# EasyEDA Pro project STM32 Minimum System.eprj

# Schematic Schematic1
Create Date: 2023-11-04; Page Name: P1; Project Name: STM32 Minimum System; Schematic Name: Schematic1; Update Date: 2023-12-27; Company: EasyEDA.com; Drawed: EasyEDA Pro; Page Size: A3; Part Number: JLCPCB-001; Reviewed: EasyEDA Pro; Version: V0.1
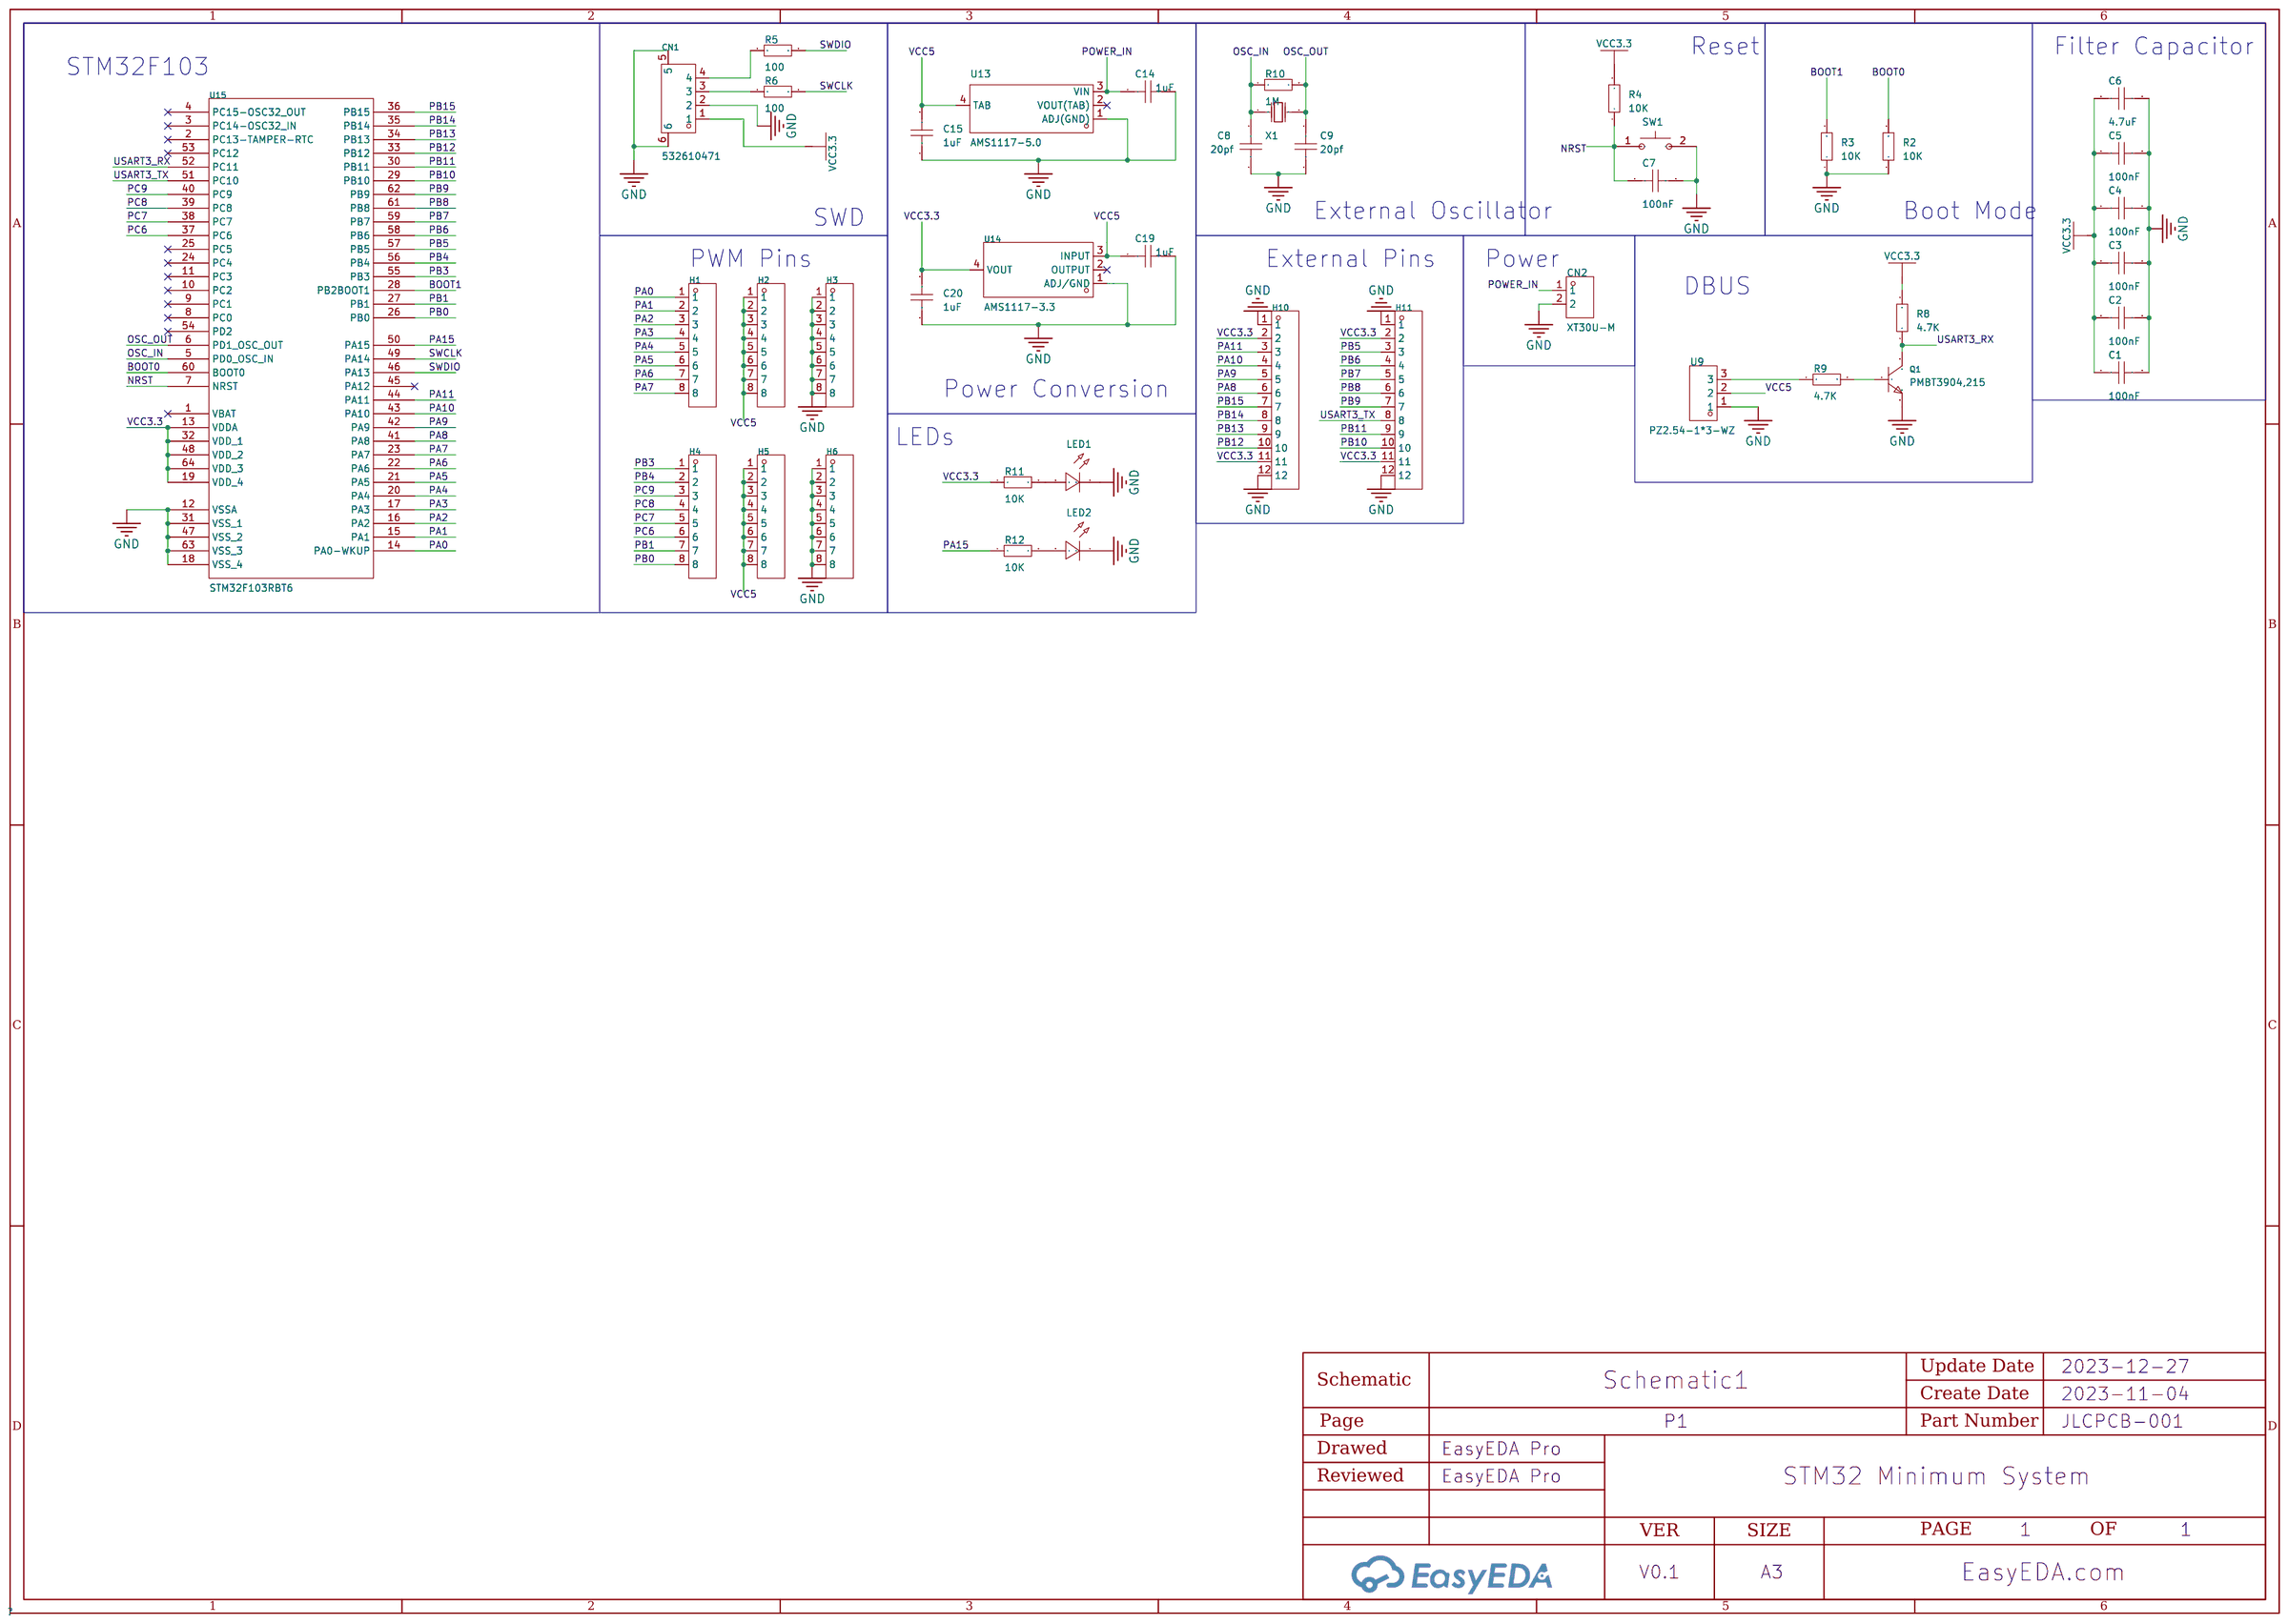
[diagram p0: schematic sheet]

## Parts
C1  100nF  [C0603]
C2  100nF  [C0603]
C3  100nF  [C0603]
C4  100nF  [C0603]
C5  100nF  [C0603]
C6  4.7uF  [C0603]
C7  100nF  [C0603]
C8  20pf  [C0603]
C9  20pf  [C0603]
C14  1uF  [C0603]
C15  1uF  [C0603]
C19  1uF  [C0603]
C20  1uF  [C0603]
CN1  532610471  [CONN-SMD_4P-P1.25_53261-0471]
CN2  XT30U-M  [CONN-TH_XT30U-M]
H1  KH-2.54PH180-1X8P-L11.5  [HDR-TH_8P-P2.54-V-M]
H2  KH-2.54PH180-1X8P-L11.5  [HDR-TH_8P-P2.54-V-M]
H3  KH-2.54PH180-1X8P-L11.5  [HDR-TH_8P-P2.54-V-M]
H4  KH-2.54PH180-1X8P-L11.5  [HDR-TH_8P-P2.54-V-M]
H5  KH-2.54PH180-1X8P-L11.5  [HDR-TH_8P-P2.54-V-M]
H6  KH-2.54PH180-1X8P-L11.5  [HDR-TH_8P-P2.54-V-M]
H10  KH-2.54PH180-1X12P-L11.5  [HDR-TH_12P-P2.54-V-M]
H11  KH-2.54PH180-1X12P-L11.5  [HDR-TH_12P-P2.54-V-M]
LED1  -  [LED0603-RD_GREEN]
LED2  -  [LED0603-BI_RG]
Q1  PMBT3904,215  [SOT-23_L2.9-W1.3-P1.90-LS2.4-BR]
R2  10K  [R0603]
R3  10K  [R0603]
R4  10K  [R0603]
R5  100  [R0603]
R6  100  [R0603]
R8  4.7K  [R0603]
R9  4.7K  [R0603]
R10  1M  [R0603]
R11  10K  [R0603]
R12  10K  [R0603]
SW1  1TS002C-2300-4300-CT  [SW-SMD_L6.0-W3.5-LS8.0-EH]
U9  PZ2.54-1*3-WZ  [HDR-TH_3P-P2.54-H-M-W7.7-P]
U13  AMS1117-5.0  [SOT-223_L6.7-W3.5-P2.30-BR]
U14  AMS1117-3.3  [SOT-223-3_L6.5-W3.4-P2.30-LS7.0-BR]
U15  STM32F103RBT6  [LQFP-64_L10.0-W10.0-P0.50-LS12.0-BL]
X1  8MHz  [CRYSTAL-SMD_L11.5-W4.8-LS12.7]

## Library data of the parts
C1-C9 C14 C15 C19 C20 = CAP_0603: Supplier Footprint: 0603
CN1 = 532610471: Reference Series:- Pitch:1.25mm Pins Structure:1x4P Number of Rows:1 Number of PINs Per Row:4 Row Spacing:- Mounting Style:- Contact Material:bronze; LCSC Part Name: 间距:1.25mm 1x4P; Supplier Part: C240847; Manufacturer: MOLEX; Supplier Footprint: SMD,P=1.25mm; JLCPCB Part Class: Extended Part; Datasheet: https://atta.szlcsc.com/upload/public/pdf/source/20180801/C240848_05185111BCEC053393D7785380F62CFD.pdf; Supplier: LCSC; Pitch: 1.25mm; Pins Structure: 1x4P; Number of Rows: 1; Number of PINs Per Row: 4; Contact Material: bronze
CN2 = XT30U-M: LCSC Part Name: AMASS(艾迈斯)轻量版锂电池插头公头 XT30U-M; Supplier Part: C99101; Manufacturer: AMASS(艾迈斯); JLCPCB Part Class: Extended Part; Datasheet: https://atta.szlcsc.com/upload/public/pdf/source/20170606/1496716542582.pdf; Supplier: LCSC
H1-H6 = KH-2.54PH180-1X8P-L11.5: Pin Structure:1x8P Pitch:2.54mm Number of Pins:8P Mounting Type:Straight Number of Rows:Plugin Row Spacing:- Circluar Pins/Square Pins:Square Pins Current Rating (Max):3A Voltage Rating (Max):- Length of Mating Pin:6mm Insulation Height:2.5mm Length of En; LCSC Part Name: 间距:2.54mm 1x8P 直插 方针; Supplier Part: C2905487; Manufacturer: kinghelm(金航标); Supplier Footprint: 插件,P=2.54mm; JLCPCB Part Class: Extended Part; Datasheet: https://atta.szlcsc.com/upload/public/pdf/source/20211019/E207DA256892DEA6FC546F48FC628120.pdf; Supplier: LCSC; Pin Structure: 1x8P; Pitch: 2.54mm; Number of Pins: 8P; Mounting Type: Straight; Number of Rows: Plugin; Circluar Pins/Square Pins: Square Pins; Current Rating (Max): 3A; Length of Mating Pin: 6mm; Insulation Height: 2.5mm; Length of End Connection Pin: 3mm; Operating Temperature Range: -40℃~+105℃; Color: Black
H10 H11 = KH-2.54PH180-1X12P-L11.5: Pin Structure:1x12P Pitch:2.54mm Number of Pins:12P Mounting Type:Straight Number of Rows:Plugin Row Spacing:- Circluar Pins/Square Pins:Square Pins Current Rating (Max):3A Voltage Rating (Max):- Length of Mating Pin:6mm Insulation Height:2.5mm Length of; LCSC Part Name: 间距:2.54mm 1x12P 直插 方针; Supplier Part: C2905489; Manufacturer: kinghelm(金航标); Supplier Footprint: 插件,P=2.54mm; JLCPCB Part Class: Extended Part; Datasheet: https://atta.szlcsc.com/upload/public/pdf/source/20211019/907BE828B313BB62427C82BE2EF837CA.pdf; Supplier: LCSC; Pin Structure: 1x12P; Pitch: 2.54mm; Number of Pins: 12P; Mounting Type: Straight; Number of Rows: Plugin; Circluar Pins/Square Pins: Square Pins; Current Rating (Max): 3A; Length of Mating Pin: 6mm; Insulation Height: 2.5mm; Length of End Connection Pin: 3mm; Operating Temperature Range: -40℃~+105℃; Color: Black
LED1 = LED_0603-G
LED2 = LED_0603-B: Supplier Footprint: 0603
Q1 = PMBT3904,215: Transistor Type: Collector Current (Ic): Collector-Emitter Breakdown Voltage (Vceo): Power Dissipation (Pd): DC Current Gain (hFE@Ic,Vce):100@10mA,1V DC Current Gain (hFE@Ic,Vce):100@10mA,1V Transition Frequency (fT):300MHz Collector Cut-Off Current (Icbo; LCSC Part Name: NPN 电流:200mA 耐压:40V; Supplier Part: C8667; Manufacturer: Nexperia(安世); Supplier Footprint: SOT-23; JLCPCB Part Class: Extended Part; Datasheet: https://atta.szlcsc.com/upload/public/pdf/source/20210520/C8667_82CC4B18F957EC74ED6E8B4E120941E6.pdf; Supplier: LCSC; DC Current Gain (hFE@Ic,Vce): 100@10mA,1V; Transition Frequency (fT): 300MHz; Collector Cut-Off Current (Icbo): 50nA; Collector-Emitter Saturation Voltage (VCE(sat)@Ic,Ib): 300mV@50mA,5mA
R2-R6 R8-R12 = Res_0603: Supplier Footprint: 0603
SW1 = 1TS002C-2300-4300-CT: Contact Current:50mA Voltage Rating (DC):12V Power Rating:0.6W Insulation Resistance:100MΩ Circuit:SPST Mounting Style:Brick nogging Actuator Style:Rectangle button Actuator/Cap Color:White With Lamp:No Operating Force:230gf@±50gf Mechanical Life:30000次 O; LCSC Part Name: 6*3.5*4.3mm 立贴 轻触开关; Supplier Part: C319340; Manufacturer: HYP(鸿源精密); Supplier Footprint: SMD,3.5x6mm; JLCPCB Part Class: Extended Part; Datasheet: https://atta.szlcsc.com/upload/public/pdf/source/20181106/C319340_6D4557880F4EAE8D4DD4D90C9114405F.pdf; Supplier: LCSC; Contact Current: 50mA; Voltage Rating (DC): 12V; Power Rating: 0.6W; Insulation Resistance: 100MΩ; Circuit: SPST; Mounting Style: Brick nogging; Actuator Style: Rectangle button; Actuator/Cap Color: White; With Lamp: No; Operating Force: 230gf@±50gf; Mechanical Life: 30000次; Operating Temperature: -40℃~+90℃; Pin Style: Gull Wing; Switch Length: 6mm; Switch Width: 3.5mm; Switch Height: 4.3mm; Strike Gundam: NO
U9 = PZ2.54-1*3-WZ: LCSC Part Name: 单排弯针 1*3 2.54 镀金环保UL认证; Supplier Part: C5360904; Manufacturer: ZHOURI(洲日); Supplier Footprint: 弯插,P=2.54mm; JLCPCB Part Class: Extended Part; Supplier: LCSC
U13 = AMS1117-5.0_C347223: Output Type: Output Polarity:Positive Number of Outputs:1 Maximum Input Voltage:18V Output Voltage:5V~5V Output Voltage:5V~5V Dropout Voltage:1.3V@(1A) Output Current:1A Power Supply Rejection Ratio (PSRR):60dB@(120Hz); LCSC Part Name: 输入18V 输出5V 1A; Supplier Part: C347223; Manufacturer: UMW(广东友台半导体); Supplier Footprint: SOT-223; JLCPCB Part Class: Extended Part; Datasheet: https://atta.szlcsc.com/upload/public/pdf/source/20211011/50CC665C22E3A66C08379A4A74BDA25C.pdf; Supplier: LCSC; Output Polarity: Positive; Number of Outputs: 1; Maximum Input Voltage: 18V; Output Voltage: 5V~5V; Dropout Voltage: 1.3V@(1A); Output Current: 1A; Power Supply Rejection Ratio (PSRR): 60dB@(120Hz)
U14 = AMS1117-3.3_C18212698: Supplier Part: C18212698; Manufacturer: TECH PUBLIC(台舟); Supplier Footprint: SOT-223; Datasheet: https://atta.szlcsc.com/upload/public/pdf/source/20231024/2F46361C191D0B74404CBB3E85314756.pdf; Supplier: LCSC
U15 = STM32F103RBT6: CPU Core:ARM Cortex-M3 CPU Maximum Speed:72MHz Operating Voltage Range:2V~3.6V Operating Voltage Range:2V~3.6V Program Storage Size:128KB Program Memory Type:FLASH RAM Size:20KB EEPROM:- GPIO Ports Number:51 ADC (Bit):12bit DAC (Bit):- PWM (Bit):- Univers; Supplier Part: C8735; Manufacturer: ST(意法半导体); Supplier Footprint: LQFP-64(10x10); JLCPCB Part Class: Extended Part; Datasheet: https://atta.szlcsc.com/upload/public/pdf/source/20150811/1457707344439.pdf; Supplier: LCSC; CPU Core: ARM Cortex-M3; CPU Maximum Speed: 72MHz; Operating Voltage Range: 2V~3.6V; Program Storage Size: 128KB; Program Memory Type: FLASH; RAM Size: 20KB; GPIO Ports Number: 51; ADC (Bit): 12bit; Universal Serial Bus: 有; Peripheral/Function: WDT；DMA；WDT；On-chip temperature sensor; Watchdog: 有; Infrared Data Association: 有; Low-Voltage Detect: 有; Direct Memory Access: 有; Internal Oscillator: 有; Operating Temperature Range: -40℃~+85℃
X1 = X49SM8MSD2SC: Crystal Type:49SMDCrystals Frequency: Frequency Tolerance:±20ppm Frequency Tolerance:±20ppm Load Capacitance: Frequency Stability:±30ppm Frequency Stability:±30ppm Operating Temperature: Operating Temperature:; LCSC Part Name: 8MHz ±20ppm 20pF; Supplier Part: C12674; Manufacturer: YXC(扬兴晶振); Supplier Footprint: HC-49S-SMD; JLCPCB Part Class: Basic Part; Datasheet: https://atta.szlcsc.com/upload/public/pdf/source/20210329/C106809_0E91E60850A780B284B63D653DC40EA4.pdf; Supplier: LCSC; Crystal Type: 49SMDCrystals; Frequency Tolerance: ±20ppm; Frequency Stability: ±30ppm

## Nets
GND: C1.2 C2.2 C3.2 C4.2 C5.2 C6.2 C7.1 C8.2 C9.2 C14.2 C15.1 C19.2 C20.1 CN1.2 CN1.5 CN1.6 CN2.2 H3.1 H3.2 H3.3 H3.4 H3.5 H3.6 H3.7 H3.8 H6.1 H6.2 H6.3 H6.4 H6.5 H6.6 H6.7 H6.8 H10.1 H10.12 H11.1 H11.12 LED1.1(C) LED2.1(C) Q1.2 R2.1 R3.1 SW1.2(B) U9.1 U13.1(ADJ(GND)) U14.1(ADJ/GND) U15.12(VSSA) U15.18(VSS_4) U15.31(VSS_1) U15.47(VSS_2) U15.63(VSS_3)
VCC3.3: C1.1 C2.1 C3.1 C4.1 C5.1 C6.1 C20.2 CN1.1 H10.2 H10.11 H11.2 H11.11 R4.2 R8.2 R11.1 U14.4(VOUT) U15.13(VDDA) U15.19(VDD_4) U15.32(VDD_1) U15.48(VDD_2) U15.64(VDD_3)
VCC5: C15.2 C19.1 H2.1 H2.2 H2.3 H2.4 H2.5 H2.6 H2.7 H2.8 H5.1 H5.2 H5.3 H5.4 H5.5 H5.6 H5.7 H5.8 U9.2 U13.4(TAB) U14.3(INPUT)
BOOT0: R2.2 U15.60(BOOT0)
BOOT1: R3.2 U15.28(PB2BOOT1)
NRST: C7.2 R4.1 SW1.1(A) U15.7(NRST)
OSC_IN: C8.1 R10.1 U15.5(PD0 OSC_IN) X1.1(OSC1)
OSC_OUT: C9.1 R10.2 U15.6(PD1 OSC_OUT) X1.2(OSC2)
PA0: H1.1 U15.14(PA0-WKUP)
PA1: H1.2 U15.15(PA1)
PA2: H1.3 U15.16(PA2)
PA3: H1.4 U15.17(PA3)
PA4: H1.5 U15.20(PA4)
PA5: H1.6 U15.21(PA5)
PA6: H1.7 U15.22(PA6)
PA7: H1.8 U15.23(PA7)
PA8: H10.6 U15.41(PA8)
PA9: H10.5 U15.42(PA9)
PA10: H10.4 U15.43(PA10)
PA11: H10.3 U15.44(PA11)
PA15: R12.1 U15.50(PA15)
PB0: H4.8 U15.26(PB0)
PB1: H4.7 U15.27(PB1)
PB3: H4.1 U15.55(PB3)
PB4: H4.2 U15.56(PB4)
PB5: H11.3 U15.57(PB5)
PB6: H11.4 U15.58(PB6)
PB7: H11.5 U15.59(PB7)
PB8: H11.6 U15.61(PB8)
PB9: H11.7 U15.62(PB9)
PB10: H11.10 U15.29(PB10)
PB11: H11.9 U15.30(PB11)
PB12: H10.10 U15.33(PB12)
PB13: H10.9 U15.34(PB13)
PB14: H10.8 U15.35(PB14)
PB15: H10.7 U15.36(PB15)
PC6: H4.6 U15.37(PC6)
PC7: H4.5 U15.38(PC7)
PC8: H4.4 U15.39(PC8)
PC9: H4.3 U15.40(PC9)
POWER_IN: C14.1 CN2.1 U13.3(VIN)
SWCLK: R6.2 U15.49(PA14)
SWDIO: R5.2 U15.46(PA13)
USART3_RX: Q1.3 R8.1 U15.52(PC11)
USART3_TX: H11.8 U15.51(PC10)
$1N3454: CN1.4 R5.1
$1N3498: CN1.3 R6.1
$1N7012: R9.1 U9.3
$1N7013: Q1.1 R9.2
$1N12545: LED1.2(A) R11.2
$1N12687: LED2.2(A) R12.2

Not connected (* = marked no-connect by the designer): U13 2(VOUT(TAB))*; U14 2(OUTPUT)*; U15 1(VBAT)* 2(PC13-TAMPER-RTC)* 3(PC14-OSC32_IN)* 4(PC15-OSC32_OUT)* 8(PC0)* 9(PC1)* 10(PC2)* 11(PC3)* 24(PC4)* 25(PC5)* 45(PA12)* 53(PC12)* 54(PD2)*

## Notes on the sheet
- Reset
- Filter Capacitor
- STM32F103
- External Oscillator
- Boot Mode
- SWD
- PWM Pins
- External Pins
- Power
- DBUS
- Power Conversion
- LEDs

# Board PCB1
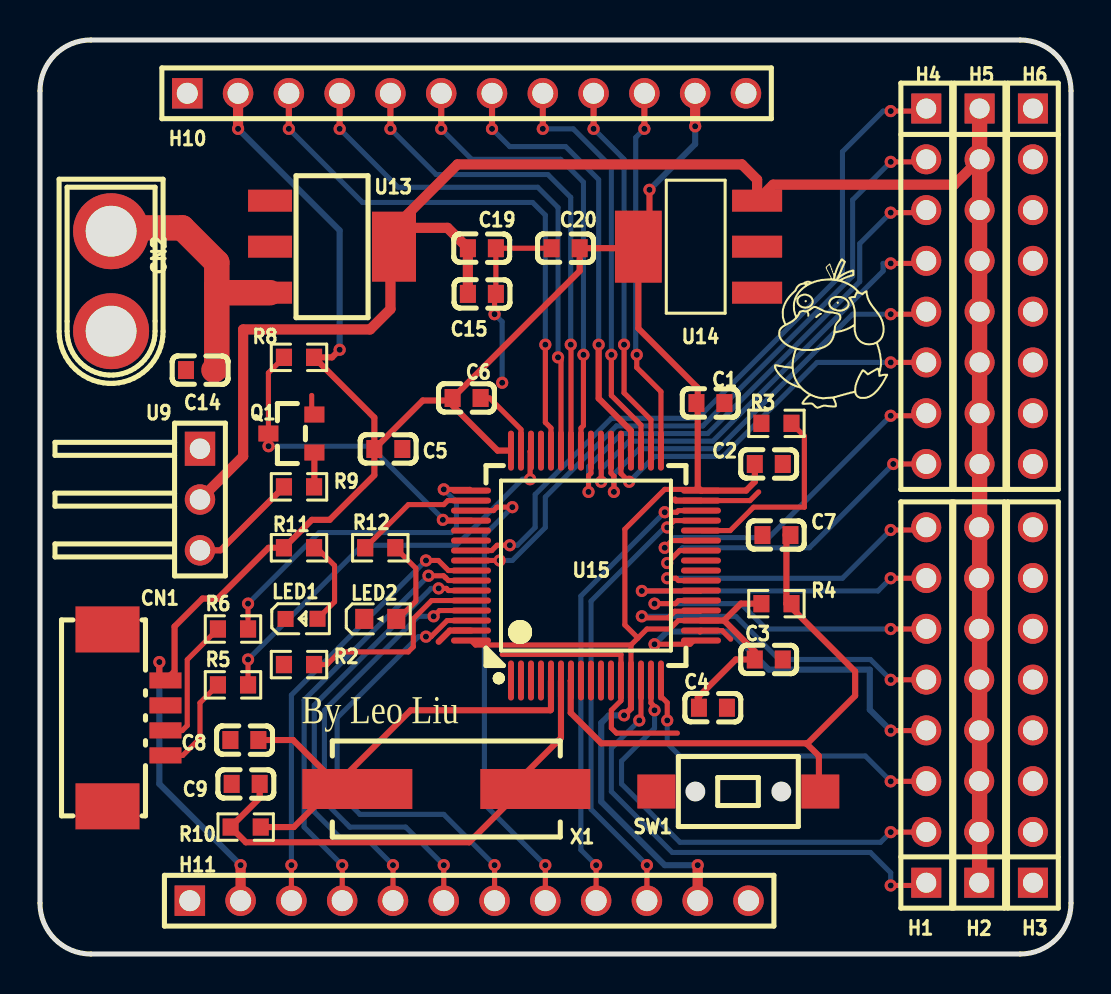
[diagram p1: board, top side]
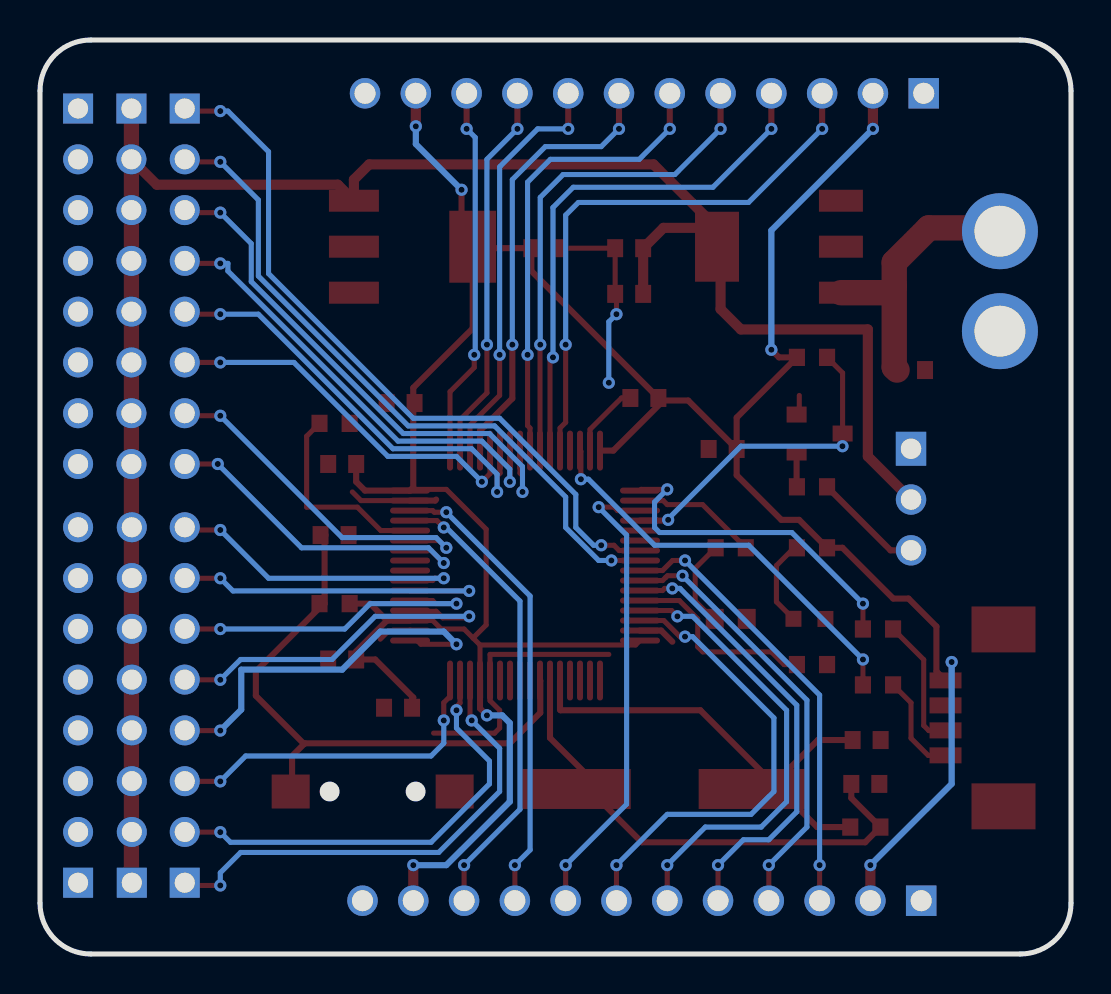
[diagram p2: board, bottom side, seen from below]

Outline 51.56 x 45.72 mm; copper layers: Top Layer, Bottom Layer. Coordinates in mm from the lower left corner of the outline.
Outline path: 0,43.18 0,2.54 arc(0.74,0.74) 2.54,0 49.02,0 arc(50.82,0.74) 51.56,2.54 51.56,43.18 arc(50.82,44.98) 49.02,45.72 2.54,45.72 arc(0.74,44.98) 0,43.18
Stack: Top Layer 0.035mm / Dielectric1 1.51mm FR4 er 4.5 / Bottom Layer 0.035mm

## Design rules (mm)
template: Custom Config
spacing copperThickness1oz (default): track to track 0.102, other pairs 0.152 to 0.3
spacing copperThickness2oz: track to track 0.203, other pairs 0.152 to 0.3
track width copperThickness1oz (default): min 0.127, default 0.254, max 2.54
track width copperThickness2oz: min 0.203, default 0.254, max 2.54
differential pair differentialPair (default): width min 0.127, default 0.254, max 2.54; gap min 0.152, default 0.152
via viaSize (default): diameter min 0.5, default 0.61, max 10; hole min 0.3, default 0.305, max 6.3

## Placement (name value [footprint] x y rotation side)
C1  100nF  [C0603]  33.53 27.56 0 top
C2  100nF  [C0603]  36.45 24.51 0 top
C3  100nF  [C0603]  36.45 14.73 0 top
C4  100nF  [C0603]  33.65 12.32 0 top
C5  100nF  [C0603]  17.42 25.26 0 top
C6  4.7uF  [C0603]  21.34 27.81 0 top
C7  100nF  [C0603]  36.83 20.95 0 top
C8  20pf  [C0603]  10.22 10.7 180 top
C9  20pf  [C0603]  10.29 8.51 180 top
C14  1uF  [C0603]  8 29.21 180 top
C15  1uF  [C0603]  22.1 33.02 180 top
C19  1uF  [C0603]  22.1 35.31 0 top
C20  1uF  [C0603]  26.29 35.31 0 top
CN1  532610471  [CONN-SMD_4P-P1.25_53261-0471]  4.83 11.81 270 top
CN2  XT30U-M  [CONN-TH_XT30U-M]  3.56 33.66 270 top
H1  KH-2.54PH180-1X8P-L11.5  [HDR-TH_8P-P2.54-V-M]  44.32 12.46 90 top
H2  KH-2.54PH180-1X8P-L11.5  [HDR-TH_8P-P2.54-V-M]  46.97 12.46 90 top
H3  KH-2.54PH180-1X8P-L11.5  [HDR-TH_8P-P2.54-V-M]  49.66 12.46 90 top
H4  KH-2.54PH180-1X8P-L11.5  [HDR-TH_8P-P2.54-V-M]  44.32 33.4 270 top
H5  KH-2.54PH180-1X8P-L11.5  [HDR-TH_8P-P2.54-V-M]  46.99 33.4 270 top
H6  KH-2.54PH180-1X8P-L11.5  [HDR-TH_8P-P2.54-V-M]  49.66 33.4 270 top
H10  KH-2.54PH180-1X12P-L11.5  [HDR-TH_12P-P2.54-V-M]  21.34 43.05 0 top
H11  KH-2.54PH180-1X12P-L11.5  [HDR-TH_12P-P2.54-V-M]  21.46 2.67 0 top
LED1  -  [LED0603-RD_GREEN]  13.08 16.76 0 top
LED2  -  [LED0603-BI_RG]  17.02 16.76 0 top
Q1  PMBT3904,215  [SOT-23_L2.9-W1.3-P1.90-LS2.4-BR]  12.57 26.03 0 top
R2  10K  [R0603]  12.95 14.48 0 top
R3  10K  [R0603]  36.83 26.54 0 top
R4  10K  [R0603]  36.83 17.53 180 top
R5  100  [R0603]  9.65 13.46 0 top
R6  100  [R0603]  9.65 16.26 0 top
R8  4.7K  [R0603]  12.95 29.84 0 top
R9  4.7K  [R0603]  12.95 23.37 0 top
R10  1M  [R0603]  10.29 6.35 180 top
R11  10K  [R0603]  12.95 20.32 0 top
R12  10K  [R0603]  17.02 20.32 0 top
SW1  1TS002C-2300-4300-CT  [SW-SMD_L6.0-W3.5-LS8.0-EH]  34.92 8.13 180 top
U9  PZ2.54-1*3-WZ  [HDR-TH_3P-P2.54-H-M-W7.7-P]  8 22.73 270 top
U13  AMS1117-5.0  [SOT-223_L6.7-W3.5-P2.30-BR]  14.61 35.38 180 top
U14  AMS1117-3.3  [SOT-223-3_L6.5-W3.4-P2.30-LS7.0-BR]  32.89 35.38 0 top
U15  STM32F103RBT6  [LQFP-64_L10.0-W10.0-P0.50-LS12.0-BL]  27.3 19.43 0 top
X1  8MHz  [CRYSTAL-SMD_L11.5-W4.8-LS12.7]  20.32 8.25 0 top

## Footprints (pads in the part's own frame, mm; a bottom-side part is the same pattern mirrored in y, then rotated)
C0603
  rect 0.8x0.9 smd: 1(-0.7,0) 2(0.7,0)
CONN-SMD_4P-P1.25_53261-0471
  rect 0.8x1.6 smd: 1(-1.875,1.45) 2(-0.625,1.45) 3(0.625,1.45) 4(1.875,1.45)
  rect 2.3x3.2 smd: 5(4.425,-1.45) 6(-4.425,-1.45)
CONN-TH_XT30U-M
  round 3.8 hole 2.54: 1(-2.5,0) 2(2.5,0)
CRYSTAL-SMD_L11.5-W4.8-LS12.7
  rect 5.5x2 smd: 1(-4.45,0) 2(4.45,0)
HDR-TH_3P-P2.54-H-M-W7.7-P
  rect 1.7x1.52 hole 1.02: 1(-2.54,0)
  round 1.52 hole 1.02: 2(0,0) 3(2.54,0)
HDR-TH_8P-P2.54-V-M
  rect 1.5x1.5 hole 1: 1(-8.89,0)
  round 1.5 hole 1: 2(-6.35,0) 3(-3.81,0) 4(-1.27,0) 5(1.27,0) 6(3.81,0) 7(6.35,0) 8(8.89,0)
HDR-TH_12P-P2.54-V-M
  rect 1.524x1.524 hole 1.05: 1(-13.97,0)
  round 1.524 hole 1.05: 2(-11.43,0) 3(-8.89,0) 4(-6.35,0) 5(-3.81,0) 6(-1.27,0) 7(1.27,0) 8(3.81,0) 9(6.35,0) 10(8.89,0) 11(11.43,0) 12(13.97,0)
LED0603-BI_RG
  rect 0.9x1 smd: 1(-0.8,0) 2(0.8,0)
LED0603-RD_GREEN
  rect 0.8x0.8 smd: 1(-0.799,-0.004) 2(0.799,0.004)
LQFP-64_L10.0-W10.0-P0.50-LS12.0-BL
  oval 0.3x2 smd: 1(-3.75,-5.75) 2(-3.25,-5.75) 3(-2.75,-5.75) 4(-2.25,-5.75) 5(-1.75,-5.75) 6(-1.25,-5.75) 7(-0.75,-5.75) 8(-0.25,-5.75) 9(0.25,-5.75) 10(0.75,-5.75) 11(1.25,-5.75) 12(1.75,-5.75) 13(2.25,-5.75) 14(2.75,-5.75) 15(3.25,-5.75) 16(3.75,-5.75) 33(3.75,5.75) 34(3.25,5.75) 35(2.75,5.75) 36(2.25,5.75) 37(1.75,5.75) 38(1.25,5.75) 39(0.75,5.75) 40(0.25,5.75) 41(-0.25,5.75) 42(-0.75,5.75) 43(-1.25,5.75) 44(-1.75,5.75) 45(-2.25,5.75) 46(-2.75,5.75) 47(-3.25,5.75) 48(-3.75,5.75)
  oval 2x0.3 smd: 17(5.75,-3.75) 18(5.75,-3.25) 19(5.75,-2.75) 20(5.75,-2.25) 21(5.75,-1.75) 22(5.75,-1.25) 23(5.75,-0.75) 24(5.75,-0.25) 25(5.75,0.25) 26(5.75,0.75) 27(5.75,1.25) 28(5.75,1.75) 29(5.75,2.25) 30(5.75,2.75) 31(5.75,3.25) 32(5.75,3.75) 49(-5.75,3.75) 50(-5.75,3.25) 51(-5.75,2.75) 52(-5.75,2.25) 53(-5.75,1.75) 54(-5.75,1.25) 55(-5.75,0.75) 56(-5.75,0.25) 57(-5.75,-0.25) 58(-5.75,-0.75) 59(-5.75,-1.25) 60(-5.75,-1.75) 61(-5.75,-2.25) 62(-5.75,-2.75) 63(-5.75,-3.25) 64(-5.75,-3.75)
R0603
  rect 0.806x0.864 smd: 1(-0.753,0) 2(0.753,0)
SOT-23_L2.9-W1.3-P1.90-LS2.4-BR
  rect 1x0.8 smd: 1(1.15,-0.95) 2(1.15,0.95) 3(-1.15,0)
SOT-223-3_L6.5-W3.4-P2.30-LS7.0-BR
  rect 2.5x1.1 smd: 1(2.97,-2.3) 2(2.97,0) 3(2.97,2.3)
  rect 2.34x3.6 smd: 4(-2.97,0)
SOT-223_L6.7-W3.5-P2.30-BR
  rect 2.2x1.1 smd: 1(3.099,-2.3) 2(3.099,0) 3(3.099,2.3)
  rect 2.2x3.5 smd: 4(-3.099,0)
SW-SMD_L6.0-W3.5-LS8.0-EH
  rect 1.9x1.7 smd: 1(-4.1,0) 2(4.1,0)

## Nets
As in the schematic.

Pads without a net: U13 2; U14 2; U15 1 2 3 4 8 9 10 11 24 25 45 53 54

## Via types
v1: diameter 0.61, hole 0.305, Top Layer to Bottom Layer, 80 vias

## Routing (per net, layer and track width the routed paths; a pad name or vN(x,y) marks a point on that pad's centre or on a via; arc(x,y) is an arc through that point)
GND: length 35.6
  Top Layer w0.254: U15.47 24.05,26.24 22.48,27.81 C6.2 ; 23.11,14.99 29.05,14.99 U15.12 29.05,12.67 28.58,12.19 28.58,11.3 28.83,11.05 31.88,11.05 ; 13.59,27.94 13.59,27.12 Q1.2 ; 34.54,15.75 34.11,16.18 U15.18 ; v1(22.73,32) 22.73,32.95 C15.1 C19.2 C20.1 ; 35.94,23.11 35.51,22.68 U15.31
  Top Layer w0.305: U15.18 33.01,16.14 ; U15.31 31.8,22.68 31.75,22.73 ; U15.63 20.5,16.18 19.94,15.62
  Bottom Layer w0.254: v1(22.73,32) 23.11,31.62 v1(23.11,28.57)
VCC3.3: length 151.9
  Top Layer w0.254: 29.9,15.81 29.25,16.46 29.25,21.25 31.24,23.24 32.99,23.24 ; 29.9,15.81 29.55,15.46 ; 29.9,15.81 30.35,16.26 31.5,16.26 31.92,16.68 U15.19 ; 29.55,15.46 U15.13 ; 29.55,15.46 21.78,15.46 U15.64
  Top Layer w0.305: U14.4 29.92,31.29 32.89,28.32 32.89,23.34 U15.32 35.31,23.18 35.75,23.62 C2.1 ; U14.4 29.92,35.69 29.54,35.31 C20.2 26.99,34.17 C6.1 ; U14.4 30.48,35.94 v1(30.48,38.23) ; C5.1 16.72,26.83 R8.2 14.61,29.84 v1(14.99,30.23) ; C5.1 19.14,27.69 20.38,27.69 22.89,25.18 U15.48 ; C5.1 16.72,23.95 14.49,21.72 13.6,21.72 R11.1 11.43,20.32 8.89,17.78 8.13,17.78 6.73,16.38 6.73,14.14 CN1.1 5.97,13.99 v1(5.97,14.6) ; C4.1 32.95,12.77 32.89,12.83 34.8,14.73 C3.1 35.75,15.14 34.21,16.68 ; 34.21,16.68 U15.19 ; 34.21,16.68 35.05,17.53 R4.2 ; v1(29.21,11.94) 29.55,12.28 U15.13
  Top Layer w0.508: H11.11 32.89,4.32 ; H10.2 v1(9.91,41.27) ; H10.11 v1(32.77,41.4) ; v1(10.03,4.44) H11.2
  Bottom Layer w0.305: v1(29.21,11.94) 28.45,11.94 28.07,11.56 28.07,7.62 31.24,4.44 v1(32.89,4.44) ; v1(30.48,38.23) 32.77,40.51 v1(32.77,41.4) ; v1(9.91,41.27) 14.99,36.19 v1(14.99,30.23) ; v1(5.97,14.6) 5.97,8.51 v1(10.03,4.44)
VCC5: length 98
  Top Layer w0.508: H5.2 45.72,38.48 36.66,38.48 U14.3 ; U9.2 10.16,24.89 10.16,31.24 16.51,31.24 17.53,32.26 17.53,35.2 U13.4 ; 35.86,37.99 35.86,38.73 35.1,39.5 20.88,39.5 17.7,36.32 20.38,36.32 C19.1 C15.2
  Top Layer w0.762: 46.97,3.58 46.99,3.6 H5.8 H5.7 H5.6 H5.5 H5.4 H5.3 H5.2 H5.1
BOOT0: length 10
  Top Layer w0.254: U15.60 19.59,17.68 18.67,16.76 18.67,15.37 18.42,15.11 14.99,15.11 14.35,14.48 R2.2
BOOT1: length 10.1
  Top Layer w0.254: R3.2 38.23,25.9 38.23,22.35 35.69,22.35 34.52,21.18 U15.28
NRST: length 29.7
  Top Layer w0.305: 38.35,10.51 38.32,10.54 28.07,10.54 26.54,12.06 26.54,13.67 U15.7 ; 38.35,10.51 38.95,9.91 38.95,8.2 SW1.1 ; 38.35,10.51 40.77,12.92 40.77,14.13 37.37,17.53 37.33,17.53 37.33,20.9 37.28,20.95
OSC_IN: length 23.2
  Top Layer w0.305: 14.85,8.51 12.66,10.7 C8.1 ; 14.85,8.51 18.54,12.19 25.53,12.19 25.55,12.22 U15.5 ; 14.85,8.51 12.7,6.35 R10.1
OSC_OUT: length 25
  Top Layer w0.305: U15.6 26.05,10.81 23.75,8.51 23.75,7.88 21.46,5.59 10.3,5.59 R10.2 10.99,7.8 C9.1
PA0: length 24.3
  Top Layer w0.254: 44.32,3.56 44.2,3.43 v1(42.55,3.43) ; v1(29.97,11.68) 30.05,11.77 U15.14
  Bottom Layer w0.254: v1(42.55,3.43) 42.55,4.06 41.53,5.08 31.62,5.08 28.58,8.13 28.58,10.29 v1(29.97,11.68)
PA1: length 22.6
  Top Layer w0.254: U15.15 30.55,12.55 30.73,12.38 v1(30.73,12.19) ; v1(42.55,6.1) 44.32,6.1
  Bottom Layer w0.254: v1(42.55,6.1) 42.04,5.59 32,5.59 29.08,8.51 29.08,9.65 30.73,11.3 v1(30.73,12.19)
PA2: length 17
  Top Layer w0.254: v1(31.37,11.68) 31.37,12.57 31.05,12.89 U15.16 ; 44.32,8.64 v1(42.55,8.64)
  Bottom Layer w0.254: v1(42.55,8.64) 41.27,9.91 32,9.91 31.37,10.54 v1(31.37,11.68)
PA3: length 19.5
  Top Layer w0.254: v1(30.73,15.49) 32.51,15.49 32.7,15.68 U15.17 ; v1(42.55,11.18) 44.32,11.18
  Bottom Layer w0.305: v1(30.73,15.49) 31.37,16.13 34.54,16.13 36.45,14.22 41.5,14.22 41.5,12.22 v1(42.55,11.18)
PA4: length 18.7
  Top Layer w0.254: v1(42.55,13.72) 44.32,13.72 ; U15.20 33.02,17.14 31.75,17.14 31.42,16.81 30.18,16.81 v1(30.1,16.89)
  Bottom Layer w0.254: v1(30.1,16.89) 34.8,16.89 36.96,14.73 41.53,14.73 v1(42.55,13.72)
PA5: length 16.5
  Top Layer w0.254: U15.21 31.93,17.68 31.77,17.53 v1(30.73,17.53) ; v1(42.55,16.26) 44.32,16.26
  Bottom Layer w0.254: v1(42.55,16.26) 36.32,16.26 35.05,17.53 v1(30.73,17.53)
PA6: length 17.5
  Top Layer w0.254: v1(30.1,18.16) 33.03,18.16 U15.22 ; v1(42.55,18.8) 44.32,18.8
  Bottom Layer w0.254: v1(42.55,18.8) 41.91,18.16 v1(30.1,18.16)
PA7: length 15.7
  Top Layer w0.254: 44.32,21.34 44.2,21.21 v1(42.55,21.21) ; U15.23 31.93,18.68 31.81,18.8 v1(31.37,18.8)
  Bottom Layer w0.254: v1(42.55,21.21) 40.13,18.8 v1(31.37,18.8)
PA8: length 23.5
  Top Layer w0.254: v1(27.18,29.97) 27.18,26.43 27.05,26.31 U15.41
  Top Layer w0.305: v1(20.07,41.27) H10.6
  Bottom Layer w0.254: v1(20.07,41.27) 21.59,39.75 26.04,39.75 27.18,38.61 v1(27.18,29.97)
PA9: length 24.9
  Top Layer w0.254: v1(26.54,30.48) 26.55,30.47 U15.42
  Top Layer w0.305: v1(17.53,41.27) H10.5
  Bottom Layer w0.254: v1(26.54,30.48) 26.54,37.85 25.4,38.99 19.81,38.99 v1(17.53,41.27)
PA10: length 26.5
  Top Layer w0.254: U15.43 26.05,29.7 v1(25.91,29.84)
  Top Layer w0.305: v1(14.99,41.27) H10.4
  Bottom Layer w0.254: v1(25.91,29.84) 25.91,37.34 24.89,38.35 17.91,38.35 v1(14.99,41.27)
PA11: length 28.3
  Top Layer w0.254: v1(25.27,30.48) 25.27,26.59 25.55,26.31 U15.44
  Top Layer w0.305: v1(12.45,41.27) 12.45,43.05
  Bottom Layer w0.254: v1(25.27,30.48) 25.27,36.96 24.64,37.59 16.13,37.59 v1(12.45,41.27)
PA15: length 6.3
  Top Layer w0.254: R12.1 18.42,22.48 20.19,22.48 20.39,22.68 U15.50
PB0: length 17
  Top Layer w0.254: v1(31.37,19.56) 31.99,20.18 U15.26 ; 44.32,24.38 44.2,24.51 v1(42.67,24.51)
  Bottom Layer w0.254: v1(31.37,19.56) 32.13,20.32 38.48,20.32 v1(42.67,24.51)
PB1: length 17.8
  Top Layer w0.254: 44.32,26.92 v1(42.55,26.92) ; U15.27 31.6,20.68 v1(31.24,20.32)
  Bottom Layer w0.254: v1(31.24,20.32) 31.75,20.83 36.45,20.83 v1(42.55,26.92)
PB3: length 36.4
  Top Layer w0.254: v1(42.55,42.16) 44.32,42.16 ; U15.55 22.59,20.18 22.86,20.45 v1(23.49,20.45)
  Bottom Layer w0.254: v1(42.55,42.16) 42.16,42.16 40.13,40.13 40.13,34.04 32.89,26.8 28.58,26.8 24.77,22.99 24.77,21.34 23.88,20.45 v1(23.49,20.45)
PB4: length 34.2
  Top Layer w0.254: v1(42.55,39.62) 44.32,39.62 ; v1(22.99,19.69) 21.56,19.69 U15.56
  Bottom Layer w0.254: v1(22.99,19.69) 23.62,19.69 25.27,21.34 25.27,22.86 28.83,26.42 33.15,26.42 40.64,33.91 40.64,37.72 v1(42.55,39.62)
PB5: length 22.3
  Top Layer w0.254: U15.57 20.43,19.18 19.92,19.69 v1(19.3,19.69) ; v1(12.57,4.44) H11.3
  Bottom Layer w0.254: v1(19.3,19.69) 12.57,12.95 v1(12.57,4.44)
PB6: length 21.8
  Top Layer w0.254: v1(15.11,4.44) H11.4 ; U15.58 20.43,18.68 20.28,18.82 20.28,18.82 20.18,18.92 v1(19.43,18.92)
  Bottom Layer w0.254: v1(19.43,18.92) 13.21,12.7 13.21,6.35 v1(15.11,4.44)
PB7: length 22.5
  Top Layer w0.254: U15.59 20.43,18.18 20.32,18.29 v1(19.94,18.29) ; v1(17.65,4.44) H11.5
  Bottom Layer w0.254: v1(19.94,18.29) 19.56,18.29 13.72,12.45 13.72,7.11 15.11,5.71 16.38,5.71 v1(17.65,4.44)
PB8: length 23.2
  Top Layer w0.254: 20.32,4.57 v1(20.19,4.44) H11.6 ; v1(19.68,16.89) 19.98,17.18 U15.61
  Bottom Layer w0.254: v1(20.19,4.44) 18.29,6.35 15.49,6.35 14.22,7.62 14.22,12.19 18.92,16.89 v1(19.68,16.89)
PB9: length 23.6
  Top Layer w0.254: v1(19.3,15.88) 19.56,15.88 20.36,16.68 U15.62 ; v1(22.73,4.44) H11.7
  Bottom Layer w0.254: v1(22.73,4.44) 20.19,6.98 16,6.98 14.86,8.13 14.86,11.81 18.92,15.88 v1(19.3,15.88)
PB10: length 23.3
  Top Layer w0.254: v1(31.37,21.34) 31.71,21.68 U15.29 ; v1(30.35,4.44) H11.10
  Bottom Layer w0.254: v1(30.35,4.44) 27.56,7.24 27.56,17.65 31.24,21.34 v1(31.37,21.34)
PB11: length 23.3
  Top Layer w0.254: v1(27.81,4.44) H11.9 ; U15.30 31.93,22.18 31.84,22.1 v1(31.24,22.1)
  Bottom Layer w0.254: v1(31.24,22.1) 27.05,17.91 27.05,5.21 v1(27.81,4.44)
PB12: length 18.6
  Top Layer w0.254: U15.33 31.05,28.13 29.85,29.34 v1(29.85,29.97)
  Top Layer w0.305: H10.10 v1(30.23,41.27)
  Bottom Layer w0.254: v1(29.85,29.97) 29.79,30.02 29.79,40.84 v1(30.23,41.27)
PB13: length 19.1
  Top Layer w0.254: v1(29.21,30.48) 29.21,28.07 30.55,26.72 U15.34
  Top Layer w0.305: H10.9 v1(27.69,41.27)
  Bottom Layer w0.254: v1(27.69,41.27) 29.21,39.75 v1(29.21,30.48)
PB14: length 20.8
  Top Layer w0.254: v1(28.58,29.97) 28.58,27.94 30.05,26.46 U15.35
  Top Layer w0.305: v1(25.15,41.27) H10.8
  Bottom Layer w0.254: v1(28.58,29.97) 28.58,39.37 26.67,41.27 v1(25.15,41.27)
PB15: length 22.4
  Top Layer w0.305: v1(22.61,41.27) H10.7 ; v1(27.94,30.48) 27.94,27.79 29.55,26.17 U15.36
  Bottom Layer w0.254: v1(22.61,41.27) 23.49,40.39 26.29,40.39 27.94,38.73 v1(27.94,30.48)
PC6: length 19.1
  Top Layer w0.254: v1(42.55,29.59) 44.2,29.59 44.32,29.46 ; U15.37 29.05,24.03 v1(29.46,23.62)
  Bottom Layer w0.254: v1(29.46,23.62) 30.73,24.89 34.16,24.89 38.86,29.59 v1(42.55,29.59)
PC7: length 22
  Top Layer w0.254: 44.32,32 v1(42.55,32) ; v1(28.7,23.11) 28.7,23.91 28.55,24.05 U15.38
  Bottom Layer w0.254: v1(28.7,23.11) 28.7,24 29.97,25.27 33.91,25.27 40.64,32 v1(42.55,32)
PC8: length 22.9
  Top Layer w0.254: v1(42.55,34.54) 44.32,34.54 ; U15.39 28.07,25.17 v1(28.07,23.62)
  Bottom Layer w0.254: v1(28.07,23.62) 28.07,24.26 29.46,25.65 33.65,25.65 42.16,34.16 42.16,34.54 v1(42.55,34.54)
PC9: length 26.7
  Top Layer w0.254: v1(27.43,23.11) 27.43,23.93 27.55,24.05 U15.40 ; v1(42.55,37.08) 44.32,37.08
  Bottom Layer w0.254: v1(42.55,37.08) 41,35.53 41,33.63 33.4,26.03 29.08,26.03 27.43,24.38 v1(27.43,23.11)
POWER_IN: length 14.3
  Top Layer w1.27: 8.84,33.41 8.84,29.35 C14.1 ; 8.84,33.41 9.17,33.08 U13.3 ; 8.84,33.41 8.84,34.59 7.11,36.32 3.72,36.32 CN2.1
SWCLK: length 16.8
  Top Layer w0.254: R6.2 v1(10.41,17.53) ; v1(20.19,23.24) 21.5,23.24 U15.49
  Bottom Layer w0.254: v1(20.19,23.24) 20.83,22.61 20.83,21.34 20.57,21.08 13.96,21.08 v1(10.41,17.53)
SWDIO: length 20.6
  Top Layer w0.254: v1(24.51,23.75) 24.51,25.14 U15.46 ; R5.2 v1(10.41,14.73)
  Bottom Layer w0.254: v1(10.41,14.73) 16.12,20.45 20.83,20.45 24.13,23.75 v1(24.51,23.75)
USART3_RX: length 16.6
  Top Layer w0.254: Q1.3 11.42,29.07 R8.1
  Top Layer w0.305: U15.52 20.18,21.68 v1(20.15,21.72) ; v1(11.43,25.4) 11.43,26.03 Q1.3
  Bottom Layer w0.254: 20.32,21.72 20.19,21.72 16.51,25.4 v1(11.43,25.4)
USART3_TX: length 23.7
  Top Layer w0.254: v1(23.62,22.35) 22.85,22.35 22.68,22.18 U15.51 ; v1(25.27,4.44) H11.8
  Bottom Layer w0.254: v1(25.27,4.44) 22.23,7.49 22.23,20.95 v1(23.62,22.35)
$1N3454: length 5.1
  Top Layer w0.254: R5.1 8,12.56 8,10.8 7.14,9.94 CN1.4
$1N3498: length 6.8
  Top Layer w0.254: R6.1 7.37,14.72 7.37,11.43 7.11,11.18 6.14,11.18
$1N7012: length 5.5
  Top Layer w0.305: R9.1 9.03,20.19 U9.3
$1N7013: length 1.7
  Top Layer w0.305: R9.2 13.72,23.38 Q1.1
$1N12545: length 4.4
  Top Layer w0.254: R11.2 13.84,20.32 14.73,19.43 14.73,17.62 LED1.2
$1N12687: length 4.4
  Top Layer w0.254: 17.87,16.76 17.91,16.76 18.8,17.65 18.8,19.3 R12.2

## Copper pours and planes (outline as drawn; the poured copper is in the pictures)
GND on Top Layer: 0,45.85 51.56,45.85 51.56,-0.13 0,-0.13

## Text on the board
Top Silkscreen Layer: By Leo Liu
